# EAGLE design i2c-lcd-backpack-r1 (EAGLE 5.12)
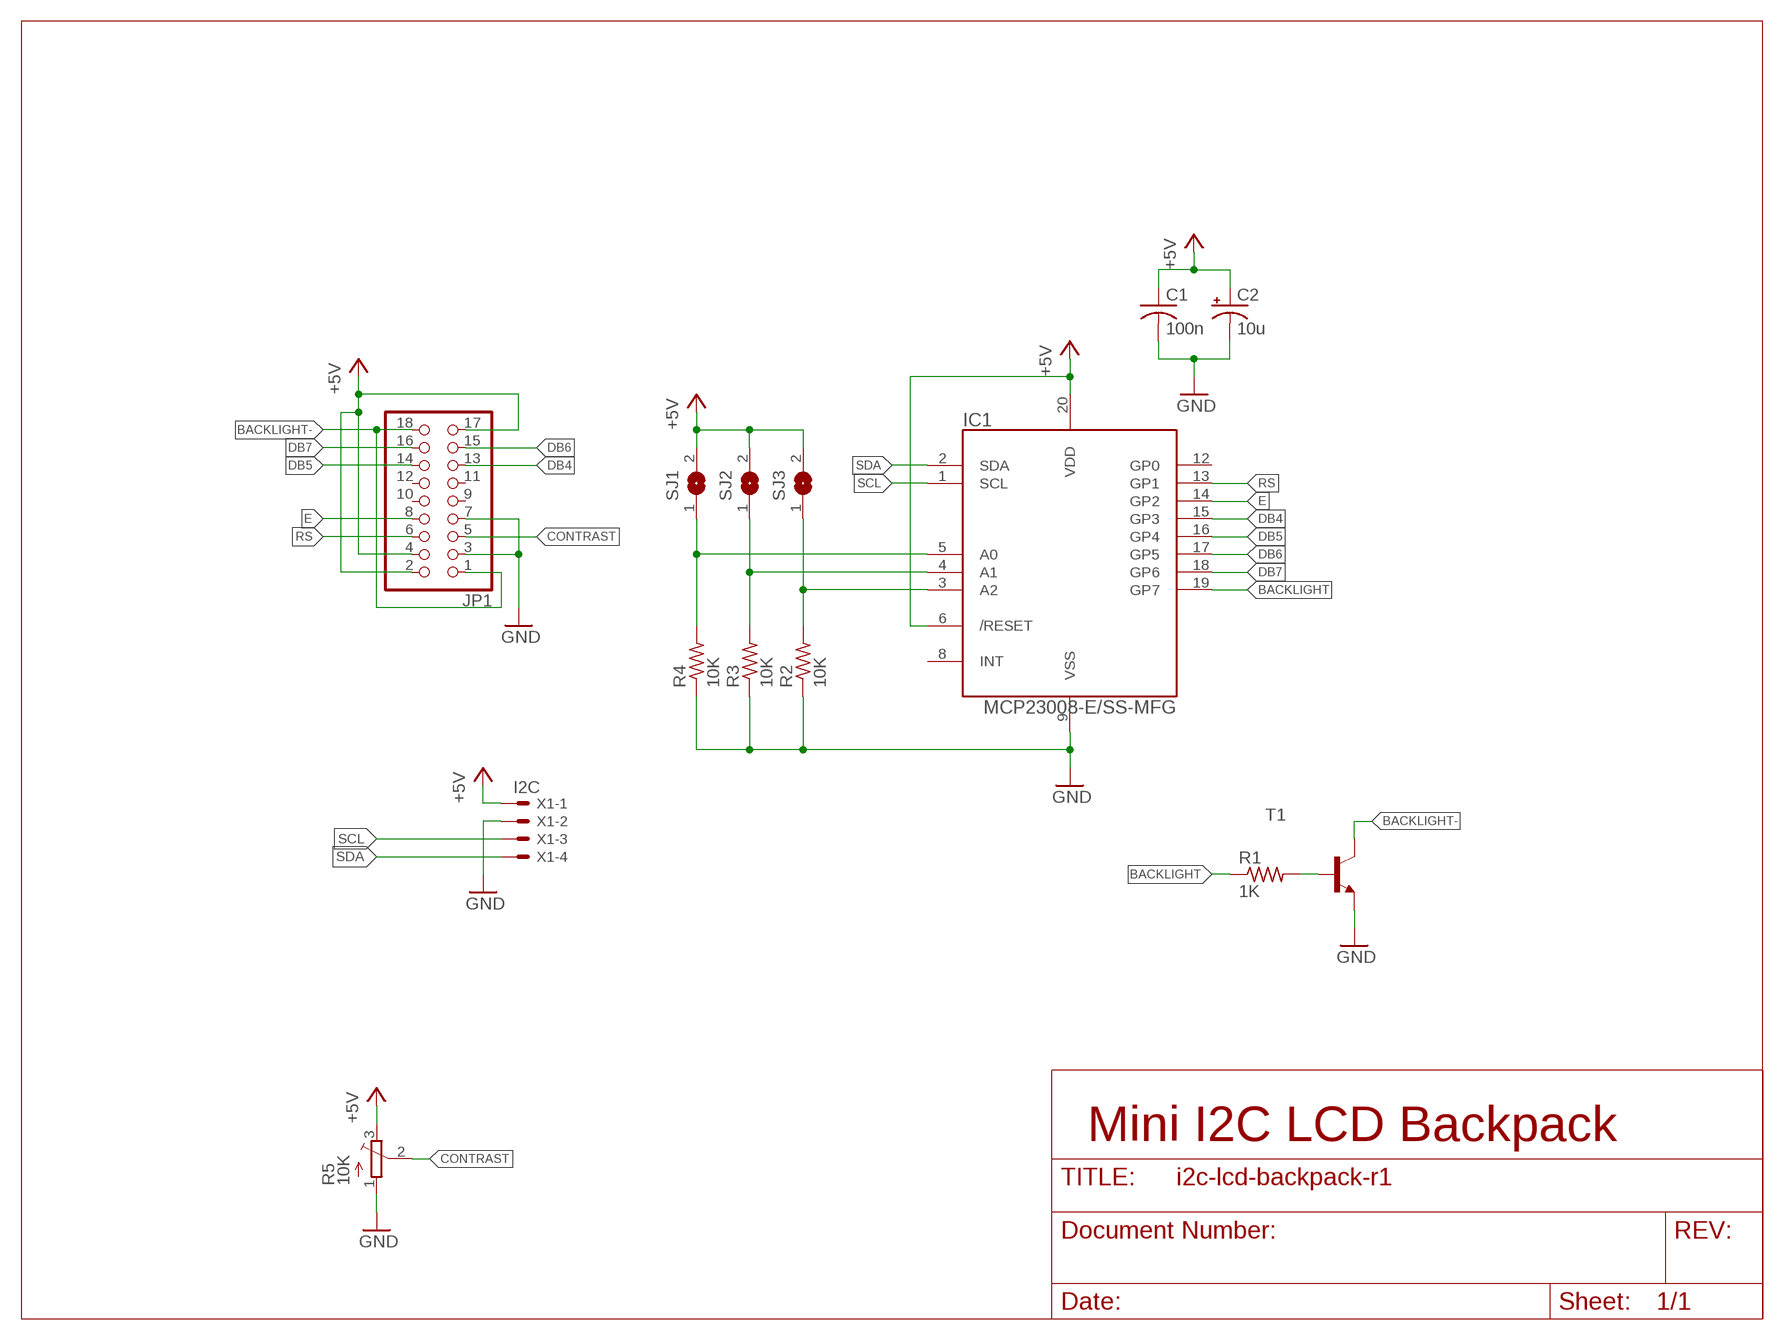
[diagram p0: schematic, sheet 1]

## Parts
C1  100n  C-USC0603  [C0603]
C2  10u  CPOL-USB  [PANASONIC_B]
IC1  MCP23008-E/SS-MFG  [SSOP-20-MFG]
JP1  PINHD-2X9  [2X09]
R1  1K  R-US_R0603  [R0603]
R2  10K  R-US_R0603  [R0603]
R3  10K  R-US_R0603  [R0603]
R4  10K  R-US_R0603  [R0603]
R5  10K  TRIMPOTTC33X  [TC33X]
SJ1  SJ  [SJ]
SJ2  SJ  [SJ]
SJ3  SJ  [SJ]
T1  MMBT3904LT1-NPN-SOT23-BEC  [SOT23-BEC]
X1  I2C  22-23-2041  [22-23-2041]

## Nets
+5V: C1.1 C2.+ IC1.6(/RESET) IC1.20(VDD) JP1.2 JP1.4 JP1.17 R5.3(E) SJ1.2 SJ2.2 SJ3.2 X1.1
BACKLIGHT: IC1.19(GP7) R1.1
BACKLIGHT-: JP1.1 JP1.18 T1.C
CONTRAST: JP1.5 R5.2(S)
DB4: IC1.15(GP3) JP1.13
DB5: IC1.16(GP4) JP1.14
DB6: IC1.17(GP5) JP1.15
DB7: IC1.18(GP6) JP1.16
E: IC1.14(GP2) JP1.8
GND: C1.2 C2.- IC1.9(VSS) JP1.3 JP1.7 R2.1 R3.1 R4.1 R5.1(A) T1.E X1.2
N$1: IC1.5(A0) R4.2 SJ1.1
N$2: IC1.4(A1) R3.2 SJ2.1
N$3: IC1.3(A2) R2.2 SJ3.1
N$4: R1.2 T1.B
RS: IC1.13(GP1) JP1.6
SCL: IC1.1(SCL) X1.3
SDA: IC1.2(SDA) X1.4
Unconnected: IC1.8(INT) IC1.12(GP0) JP1.9 JP1.10 JP1.11 JP1.12

## Notes on the sheet
- Mini I2C LCD Backpack

## Library data of the parts
C1 = rcl:C-US: CAPACITOR, American symbol
C2 = rcl:CPOL-US: POLARIZED CAPACITOR, American symbol
IC1 = rbg-microchip-ioexpander:MCP23008
JP1 = pinhead:PINHD-2X9: PIN HEADER
R1-R4 = rcl:R-US_: RESISTOR, American symbol
R5 = adafruit:TRIMPOT: SMT trimmer potentiometer part number TC33X http://www.ladyada.net/library/eagle
SJ1-SJ3 = jumper:SJ: SMD solder JUMPER
T1 = transistor:*-NPN-: NPN Transistror BF959 corrected 2008.03.06
X1 = con-molex:22-23-2041: .100" (2.54mm) Center Header - 4 Pin; MF: MOLEX; MPN: 22-23-2041; OC_FARNELL: 1462920; OC_NEWARK: 38C0355

## Board
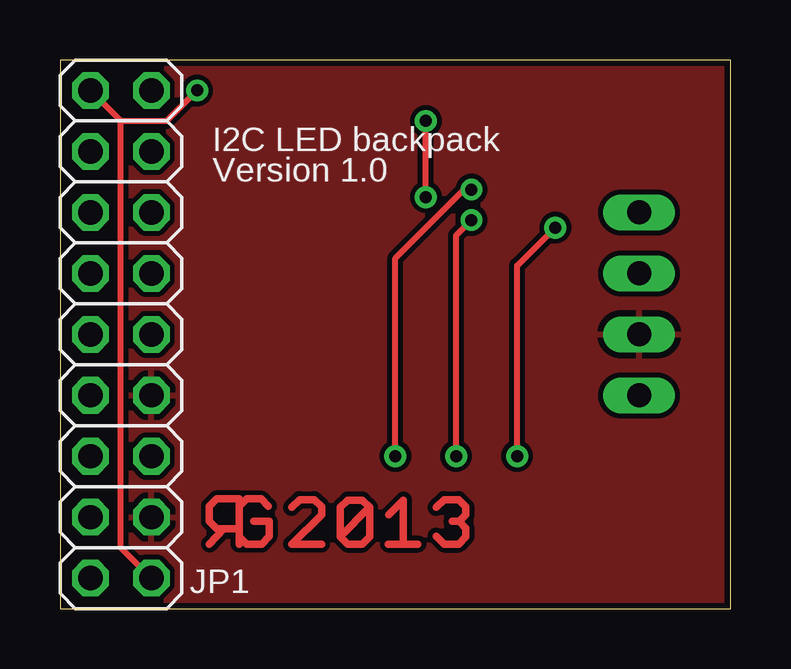
[diagram p1: board, top side]
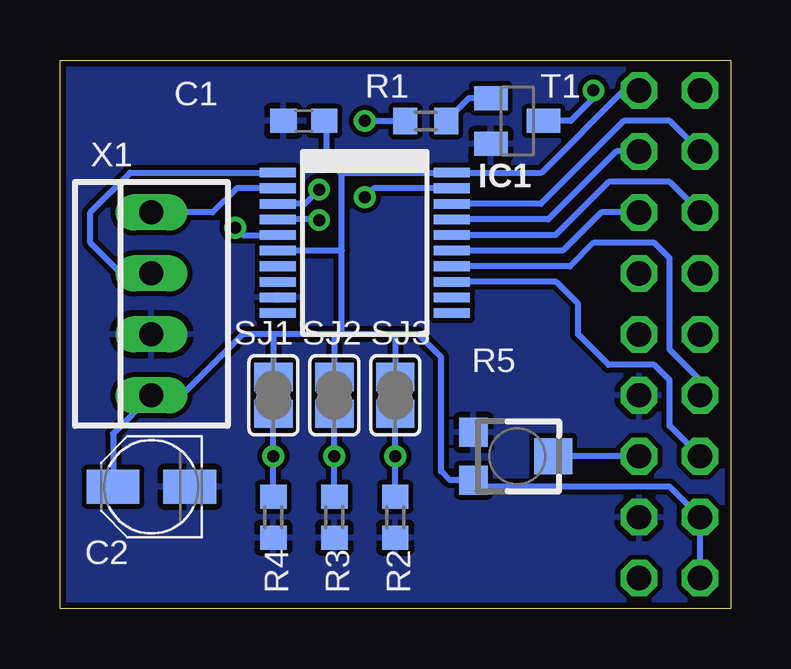
[diagram p2: board, bottom side, seen from below]

Size 27.94 x 22.86 mm. Coordinates in mm from the lower left corner, seen from the top.
Outline: 0,0 27.94,0 27.94,22.86 0,22.86 0,0
Copper layers (1*16): Top 0.035mm / dielectric 1.5mm / Bottom 0.035mm
Design rules "default *": minimum track width 10mil, minimum drill 0.5mm, track to track 8mil, track to pad 8mil, pad to pad 8mil, via to via 8mil, smd to smd 8mil, copper to edge 10mil, drill to drill 8mil, minimum pad ring 10mil, minimum via ring 8mil, stop-mask expansion 4mil, vias tented up to drill 20mil, thermal gap 10mil

### Footprints (pad centres in the part's own frame; a part is rotated, then mirrored left to right if it is on the bottom)
C0603 = smd 1.1 x 1: 1 -0.85,0; 2 0.85,0
PANASONIC_B = smd 2.2 x 1.4: + 1.6,0; - -1.6,0
SSOP-20-MFG = smd 0.4 x 1.5: 1 -2.925,-3.625; 2 -2.275,-3.625; 3 -1.625,-3.625; 4 -0.975,-3.625; 5 -0.325,-3.625; 6 0.325,-3.625; 7 0.975,-3.625; 8 1.625,-3.625; 9 2.275,-3.625; 10 2.925,-3.625; 11 2.925,3.625; 12 2.275,3.625; 13 1.625,3.625; 14 0.975,3.625; 15 0.325,3.625; 16 -0.325,3.625; 17 -0.975,3.625; 18 -1.625,3.625; 19 -2.275,3.625; 20 -2.925,3.625
2X09 = drill 1.016 octagon: 1 -10.16,-1.27; 2 -10.16,1.27; 3 -7.62,-1.27; 4 -7.62,1.27; 5 -5.08,-1.27; 6 -5.08,1.27; 7 -2.54,-1.27; 8 -2.54,1.27; 9 0,-1.27; 10 0,1.27; 11 2.54,-1.27; 12 2.54,1.27; 13 5.08,-1.27; 14 5.08,1.27; 15 7.62,-1.27; 16 7.62,1.27; 17 10.16,-1.27; 18 10.16,1.27
R0603 = smd 1 x 1.1: 1 -0.85,0; 2 0.85,0
TC33X = smd 1.2 x 1.2: 1 -1,-1.825; 3 1,-1.825 | smd 1.5 x 1.6: 2 0,1.5
SJ = smd 1.168 x 1.6: 1 -0.762,0; 2 0.762,0
SOT23-BEC = smd 1 x 1.4: B -0.95,-1.1; C 0,1.1; E 0.95,-1.1
22-23-2041 = drill 1 long: 1 -3.81,0; 2 -1.27,0; 3 1.27,0; 4 3.81,0

### Placement (x,y rotation side)
C1  17.78,20.32 180 bottom
C2  24.13,5.08 180 bottom
IC1  15.24,15.24 270 bottom
JP1  2.54,11.43 90 top
R1  12.7,20.32 0 bottom
R2  13.97,3.81 90 bottom
R3  16.51,3.81 90 bottom
R4  19.05,3.81 90 bottom
R5  8.89,6.35 270 bottom
SJ1  19.05,8.89 90 bottom
SJ2  16.51,8.89 90 bottom
SJ3  13.97,8.89 90 bottom
T1  8.89,20.32 270 bottom
U$1  [RGLOGO_SMALL_2013]  7.62,2.54 0 top
X1  24.13,12.7 90 bottom

### Tracks (layer width: path | path; a pad name or v marks a point on that pad's centre or on a via)
+5V
  Bottom 0.254: 16.83,20 16.93,20.11 C1.1 16.83,20.22 16.83,18.73 16.19,18.1 | 16.19,18.1 16.12,18.16 IC1.20 7.87,18.16 4.45,21.59 JP1.17 | 19.05,11.43 SJ1.2 | 16.51,11.43 19.05,11.43 | 16.51,11.43 SJ2.2 | 13.97,11.43 SJ3.2 | 13.97,11.43 16.19,11.43 | 16.19,11.43 16.51,11.43 | 19.05,11.43 20.32,11.43 22.86,8.89 X1.1 25.73,7.29 C2.+ | 13.97,11.43 13.02,11.43 12.06,10.48 12.06,5.71 11.7,5.35 R5.3 10.45,5.08 2.54,5.08 JP1.4 JP1.2 | 16.19,11.43 16.19,14.92 | 16.19,14.92 16.19,18.1 | IC1.6 16.2,14.91 16.19,14.92
BACKLIGHT  (via drill 0.5)
  Top 0.254: v15.24,17.14 v15.24,20.32
  Bottom 0.254: v15.24,20.32 R1.1 | IC1.19 14.87,17.52 v15.24,17.14
BACKLIGHT-  (via drill 0.5)
  Top 0.254: JP1.1 2.54,2.54 2.54,20.32 | 2.54,20.32 JP1.18 | v5.71,21.59 4.45,20.32 2.54,20.32
  Bottom 0.254: T1.C 6.67,20.32 5.71,21.27 v5.71,21.59
CONTRAST
  Bottom 0.254: JP1.5 R5.2
DB4
  Bottom 0.254: IC1.15 6.99,14.91 5.4,16.51 JP1.13
DB5
  Bottom 0.254: IC1.16 7.29,15.56 5.08,17.78 2.54,17.78 JP1.14
DB6
  Bottom 0.254: IC1.17 7.6,16.21 4.76,19.05 JP1.15
DB7
  Bottom 0.254: IC1.18 7.9,16.86 4.45,20.32 2.54,20.32 JP1.16
E
  Bottom 0.254: IC1.14 6.69,14.27 5.71,15.24 3.17,15.24 2.54,14.61 2.54,10.79 1.27,9.53 JP1.8
GND
  pour Bottom: 0,22.86 27.94,22.86 27.94,0 0,0
  pour Top: 0,22.86 27.94,22.86 27.94,0 0,0
N$1  (via drill 0.5)
  Top 0.254: v20.64,15.88 19.05,14.29 v19.05,6.35
  Bottom 0.254: IC1.5 20.33,15.56 v20.64,15.88 | SJ1.1 v19.05,6.35 R4.2
N$2  (via drill 0.5)
  Top 0.254: v17.14,16.19 16.51,15.56 v16.51,6.35
  Bottom 0.254: IC1.4 17.17,16.21 v17.14,16.19 | R3.2 v16.51,6.35 SJ2.1
N$3  (via drill 0.5)
  Top 0.254: v17.14,17.46 16.83,17.46 13.97,14.61 v13.97,6.35
  Bottom 0.254: IC1.3 17.74,16.86 v17.14,17.46 | R2.2 v13.97,6.35 SJ3.1
N$4
  Bottom 0.254: T1.B 10.9,21.27 R1.2
RS
  Bottom 0.254: IC1.13 7.26,13.62 6.35,12.7 6.35,11.43 5.08,10.16 3.17,10.16 2.54,9.53 2.54,7.62 JP1.6
SCL
  Bottom 0.254: IC1.1 25.02,18.16 26.67,16.51 26.67,15.24 25.4,13.97 X1.3
SDA
  Bottom 0.254: IC1.2 20.59,17.52 21.59,16.51 X1.4

### Text on the board
tPlace: I2C LED backpack | Version 1.0